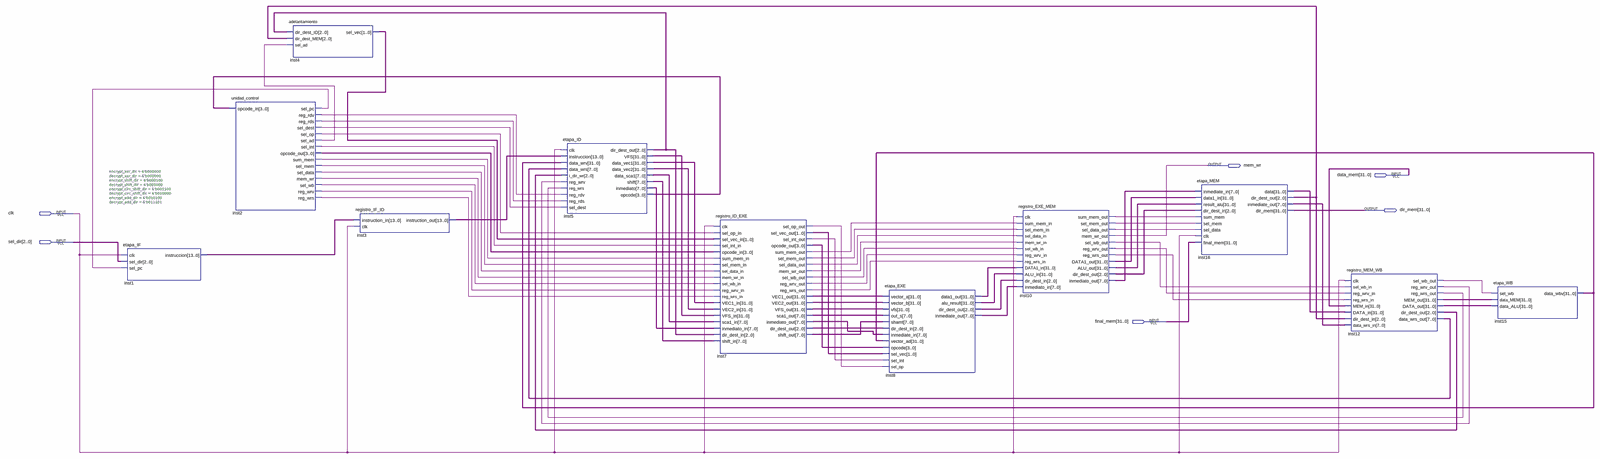
[diagram p0: schematic sheet, whole]
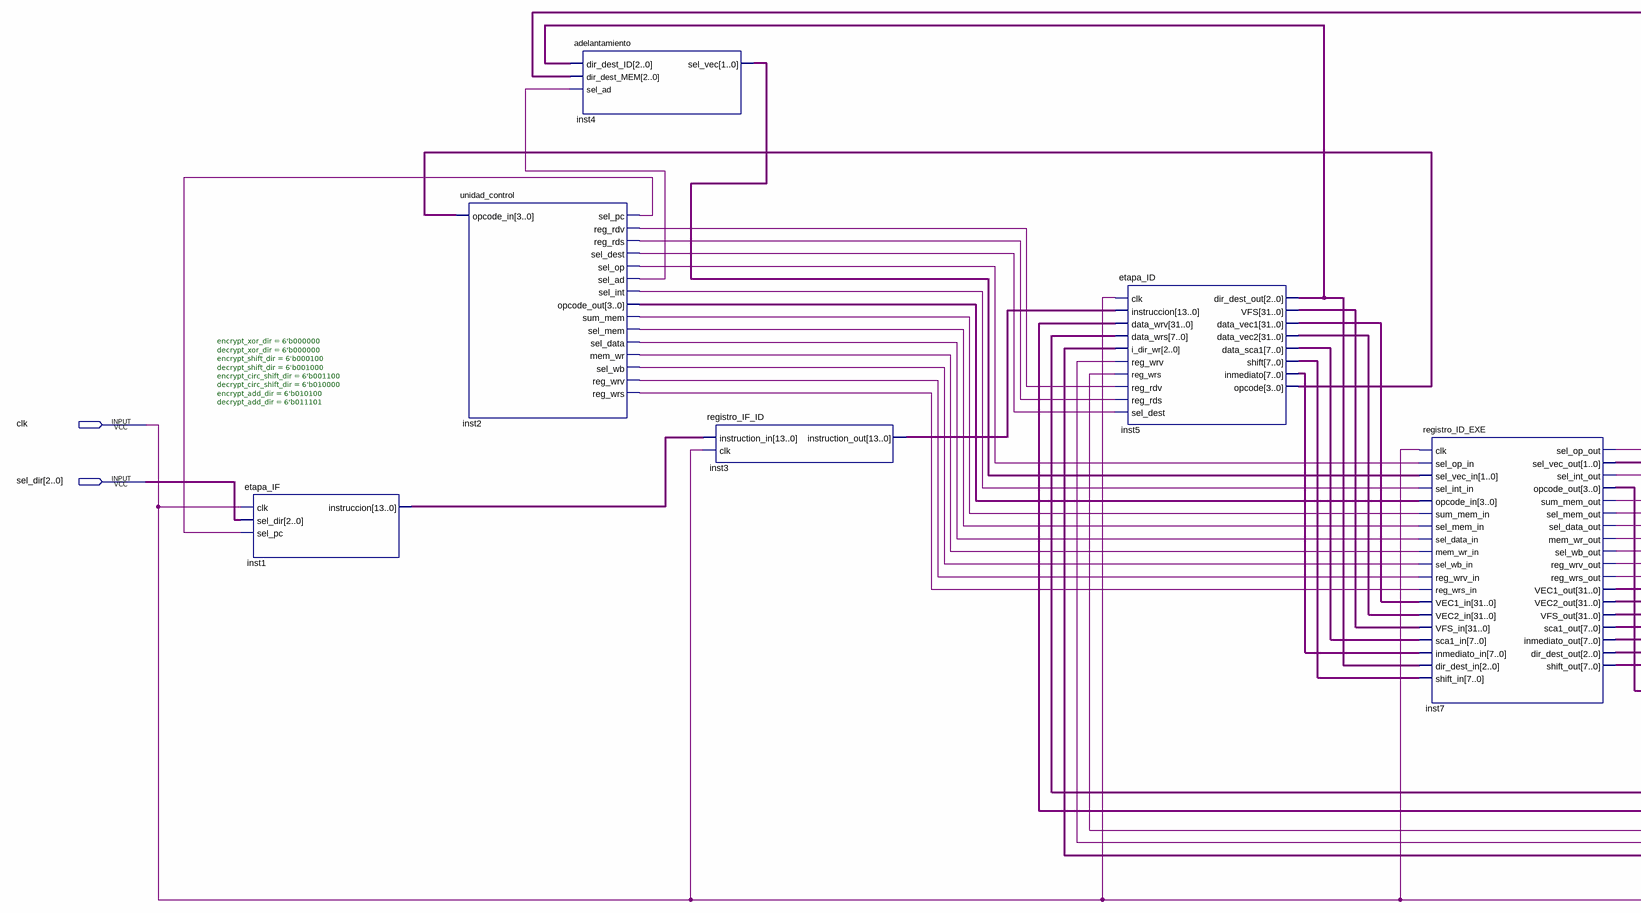
[diagram p1: schematic sheet, left part]
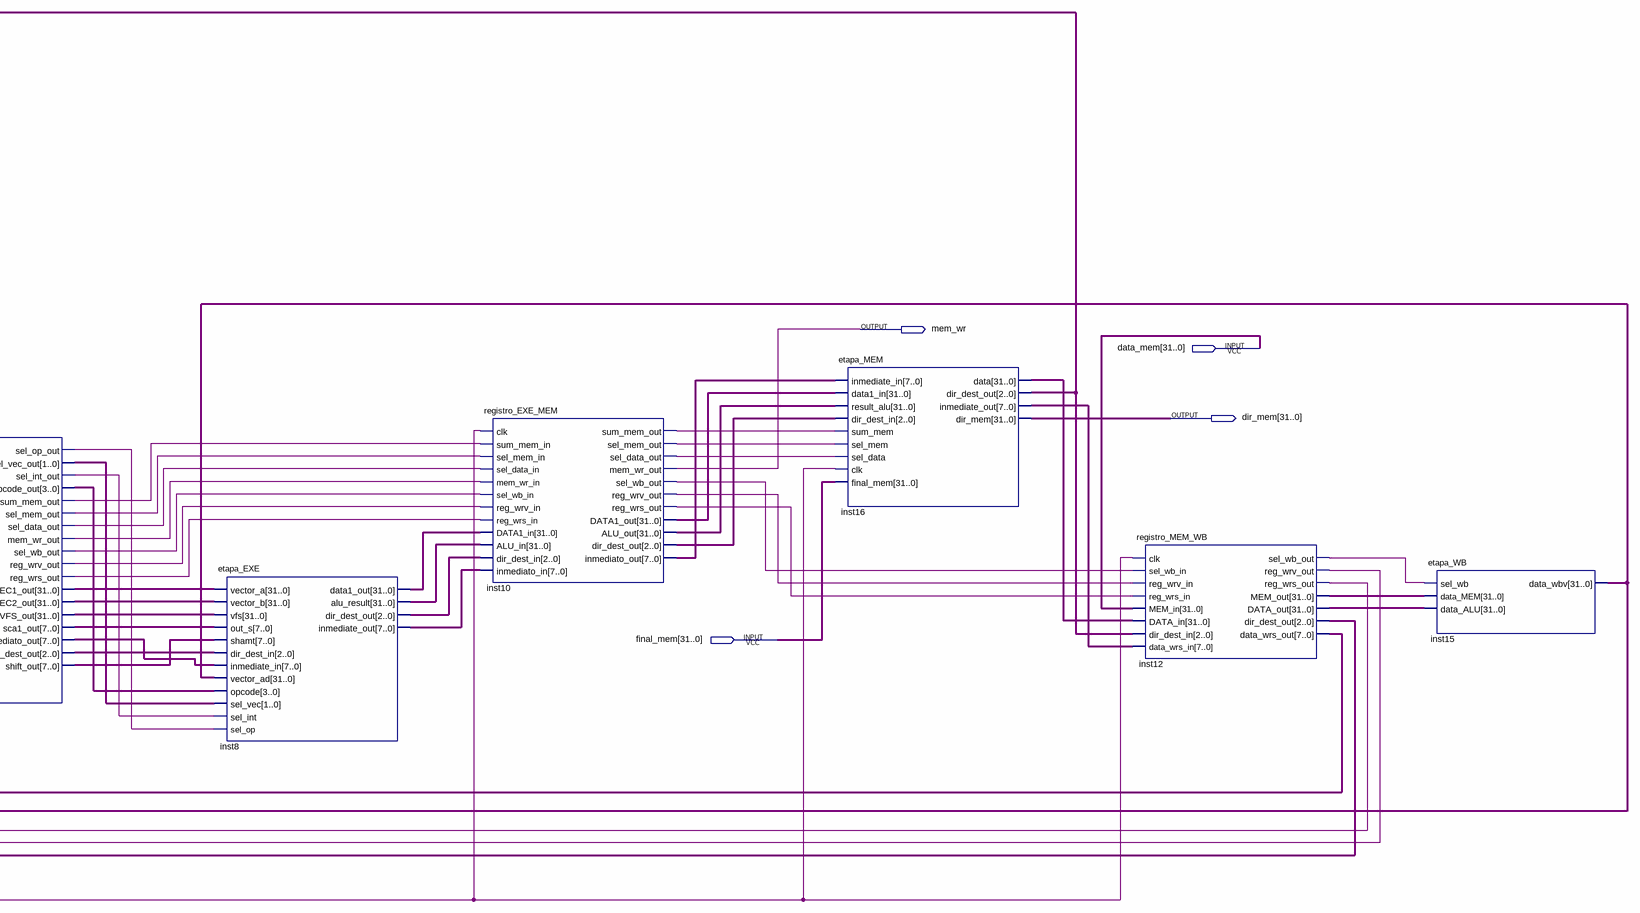
[diagram p2: schematic sheet, right part]
// Quartus schematic ProVec.bdf as structural Verilog: 11 symbols, 6 pins
module ProVec (
  input  [31:0] data_mem,
  input  clk,
  input  [2:0] sel_dir,
  input  [31:0] final_mem,
  output mem_wr,
  output [31:0] dir_mem
);

  wire inst2_mem_wr, inst2_reg_rds, inst2_reg_rdv, inst2_reg_wrs, inst2_reg_wrv, inst2_sel_ad,
       inst2_sel_data, inst2_sel_dest, inst2_sel_int, inst2_sel_mem, inst2_sel_op, inst2_sel_pc,
       inst2_sel_wb, inst2_sum_mem, inst7_mem_wr_out, inst7_reg_wrs_out, inst7_reg_wrv_out,
       inst7_sel_data_out, inst7_sel_int_out, inst7_sel_mem_out, inst7_sel_op_out, inst7_sel_wb_out,
       inst7_sum_mem_out, inst10_reg_wrs_out, inst10_reg_wrv_out, inst10_sel_data_out, inst10_sel_mem_out,
       inst10_sel_wb_out, inst10_sum_mem_out, inst12_reg_wrs_out, inst12_reg_wrv_out, inst12_sel_wb_out;
  wire [1:0] inst4_sel_vec, inst7_sel_vec_out;
  wire [2:0] inst5_dir_dest_out, inst7_dir_dest_out, inst8_dir_dest_out, inst10_dir_dest_out,
       inst12_dir_dest_out, inst16_dir_dest_out;
  wire [3:0] inst2_opcode_out, inst5_opcode, inst7_opcode_out;
  wire [7:0] inst5_data_sca1, inst5_inmediato, inst5_shift, inst7_inmediato_out, inst7_sca1_out,
       inst7_shift_out, inst8_inmediate_out, inst10_inmediato_out, inst12_data_wrs_out, inst16_inmediate_out;
  wire [13:0] inst1_instruccion, inst3_instruction_out;
  wire [31:0] inst5_data_vec1, inst5_data_vec2, inst5_vfs, inst7_vec1_out, inst7_vec2_out, inst7_vfs_out,
       inst8_alu_result, inst8_data1_out, inst10_alu_out, inst10_data1_out, inst12_data_out, inst12_mem_out,
       inst15_data_wbv, inst16_data;

  etapa_IF #(.encrypt_xor_dir(6'b000000), .decrypt_xor_dir(6'b000000), .encrypt_shift_dir(6'b000100), .decrypt_shift_dir(6'b001000), .encrypt_circ_shift_dir(6'b001100), .decrypt_circ_shift_dir(6'b010000), .encrypt_add_dir(6'b010100), .decrypt_add_dir(6'b011101)) inst1 (
    .clk(clk), .sel_dir(sel_dir), .sel_pc(inst2_sel_pc), .instruccion(inst1_instruccion));
  unidad_control inst2 (
    .opcode_in(inst5_opcode), .sel_pc(inst2_sel_pc), .reg_rdv(inst2_reg_rdv), .reg_rds(inst2_reg_rds),
    .sel_dest(inst2_sel_dest), .sel_op(inst2_sel_op), .sel_ad(inst2_sel_ad), .sel_int(inst2_sel_int),
    .opcode_out(inst2_opcode_out), .sum_mem(inst2_sum_mem), .sel_mem(inst2_sel_mem),
    .sel_data(inst2_sel_data), .mem_wr(inst2_mem_wr), .sel_wb(inst2_sel_wb), .reg_wrv(inst2_reg_wrv),
    .reg_wrs(inst2_reg_wrs));
  adelantamiento inst4 (
    .dir_dest_ID(inst5_dir_dest_out), .dir_dest_MEM(inst16_dir_dest_out), .sel_ad(inst2_sel_ad),
    .sel_vec(inst4_sel_vec));
  registro_IF_ID inst3 (.instruction_in(inst1_instruccion), .clk(clk), .instruction_out(inst3_instruction_out));
  etapa_ID inst5 (
    .clk(clk), .instruccion(inst3_instruction_out), .data_wrv(inst15_data_wbv),
    .data_wrs(inst12_data_wrs_out), .i_dir_wr(inst12_dir_dest_out), .reg_wrv(inst12_reg_wrv_out),
    .reg_wrs(inst12_reg_wrs_out), .reg_rdv(inst2_reg_rdv), .reg_rds(inst2_reg_rds),
    .sel_dest(inst2_sel_dest), .dir_dest_out(inst5_dir_dest_out), .VFS(inst5_vfs),
    .data_vec1(inst5_data_vec1), .data_vec2(inst5_data_vec2), .data_sca1(inst5_data_sca1),
    .shift(inst5_shift), .inmediato(inst5_inmediato), .opcode(inst5_opcode));
  registro_ID_EXE inst7 (
    .clk(clk), .sel_op_in(inst2_sel_op), .sel_vec_in(inst4_sel_vec), .sel_int_in(inst2_sel_int),
    .opcode_in(inst2_opcode_out), .sum_mem_in(inst2_sum_mem), .sel_mem_in(inst2_sel_mem),
    .sel_data_in(inst2_sel_data), .mem_wr_in(inst2_mem_wr), .sel_wb_in(inst2_sel_wb),
    .reg_wrv_in(inst2_reg_wrv), .reg_wrs_in(inst2_reg_wrs), .VEC1_in(inst5_data_vec1),
    .VEC2_in(inst5_data_vec2), .VFS_in(inst5_vfs), .sca1_in(inst5_data_sca1), .inmediato_in(inst5_inmediato),
    .dir_dest_in(inst5_dir_dest_out), .shift_in(inst5_shift), .sel_op_out(inst7_sel_op_out),
    .sel_vec_out(inst7_sel_vec_out), .sel_int_out(inst7_sel_int_out), .opcode_out(inst7_opcode_out),
    .sum_mem_out(inst7_sum_mem_out), .sel_mem_out(inst7_sel_mem_out), .sel_data_out(inst7_sel_data_out),
    .mem_wr_out(inst7_mem_wr_out), .sel_wb_out(inst7_sel_wb_out), .reg_wrv_out(inst7_reg_wrv_out),
    .reg_wrs_out(inst7_reg_wrs_out), .VEC1_out(inst7_vec1_out), .VEC2_out(inst7_vec2_out),
    .VFS_out(inst7_vfs_out), .sca1_out(inst7_sca1_out), .inmediato_out(inst7_inmediato_out),
    .dir_dest_out(inst7_dir_dest_out), .shift_out(inst7_shift_out));
  etapa_EXE inst8 (
    .vector_a(inst7_vec1_out), .vector_b(inst7_vec2_out), .vfs(inst7_vfs_out), .out_s(inst7_sca1_out),
    .shamt(inst7_shift_out), .dir_dest_in(inst7_dir_dest_out), .inmediate_in(inst7_inmediato_out),
    .vector_ad(inst15_data_wbv), .opcode(inst7_opcode_out), .sel_vec(inst7_sel_vec_out),
    .sel_int(inst7_sel_int_out), .sel_op(inst7_sel_op_out), .data1_out(inst8_data1_out),
    .alu_result(inst8_alu_result), .dir_dest_out(inst8_dir_dest_out), .inmediate_out(inst8_inmediate_out));
  registro_EXE_MEM inst10 (
    .clk(clk), .sum_mem_in(inst7_sum_mem_out), .sel_mem_in(inst7_sel_mem_out),
    .sel_data_in(inst7_sel_data_out), .mem_wr_in(inst7_mem_wr_out), .sel_wb_in(inst7_sel_wb_out),
    .reg_wrv_in(inst7_reg_wrv_out), .reg_wrs_in(inst7_reg_wrs_out), .DATA1_in(inst8_data1_out),
    .ALU_in(inst8_alu_result), .dir_dest_in(inst8_dir_dest_out), .inmediato_in(inst8_inmediate_out),
    .sum_mem_out(inst10_sum_mem_out), .sel_mem_out(inst10_sel_mem_out), .sel_data_out(inst10_sel_data_out),
    .mem_wr_out(mem_wr), .sel_wb_out(inst10_sel_wb_out), .reg_wrv_out(inst10_reg_wrv_out),
    .reg_wrs_out(inst10_reg_wrs_out), .DATA1_out(inst10_data1_out), .ALU_out(inst10_alu_out),
    .dir_dest_out(inst10_dir_dest_out), .inmediato_out(inst10_inmediato_out));
  etapa_MEM inst16 (
    .inmediate_in(inst10_inmediato_out), .data1_in(inst10_data1_out), .result_alu(inst10_alu_out),
    .dir_dest_in(inst10_dir_dest_out), .sum_mem(inst10_sum_mem_out), .sel_mem(inst10_sel_mem_out),
    .sel_data(inst10_sel_data_out), .clk(clk), .final_mem(final_mem), .data(inst16_data),
    .dir_dest_out(inst16_dir_dest_out), .inmediate_out(inst16_inmediate_out), .dir_mem(dir_mem));
  registro_MEM_WB inst12 (
    .clk(clk), .sel_wb_in(inst10_sel_wb_out), .reg_wrv_in(inst10_reg_wrv_out),
    .reg_wrs_in(inst10_reg_wrs_out), .MEM_in(data_mem), .DATA_in(inst16_data),
    .dir_dest_in(inst16_dir_dest_out), .data_wrs_in(inst16_inmediate_out), .sel_wb_out(inst12_sel_wb_out),
    .reg_wrv_out(inst12_reg_wrv_out), .reg_wrs_out(inst12_reg_wrs_out), .MEM_out(inst12_mem_out),
    .DATA_out(inst12_data_out), .dir_dest_out(inst12_dir_dest_out), .data_wrs_out(inst12_data_wrs_out));
  etapa_WB inst15 (
    .sel_wb(inst12_sel_wb_out), .data_MEM(inst12_mem_out), .data_ALU(inst12_data_out),
    .data_wbv(inst15_data_wbv));
endmodule
